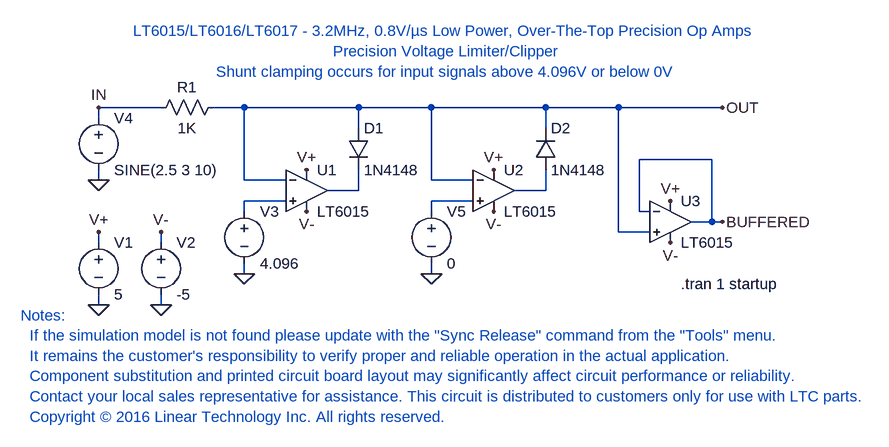
[diagram p0: schematic LT6015_VoltageLimiter.asc]
LT6015_VoltageLimiter.asc, the LTspice schematic file:
Version 4
SHEET 1 1976 820
WIRE 224 64 128 64
WIRE 352 64 304 64
WIRE 528 64 352 64
WIRE 640 64 528 64
WIRE 816 64 640 64
WIRE 928 64 816 64
WIRE 1088 64 928 64
WIRE 128 80 128 64
WIRE 528 96 528 64
WIRE 816 96 816 64
WIRE 1072 144 960 144
WIRE 128 176 128 160
WIRE 352 176 352 64
WIRE 416 176 352 176
WIRE 640 176 640 64
WIRE 704 176 640 176
WIRE 528 192 528 160
WIRE 528 192 480 192
WIRE 816 192 816 160
WIRE 816 192 768 192
WIRE 416 208 352 208
WIRE 704 208 640 208
WIRE 352 224 352 208
WIRE 640 224 640 208
WIRE 960 224 960 144
WIRE 976 224 960 224
WIRE 1072 240 1072 144
WIRE 1072 240 1040 240
WIRE 1088 240 1072 240
WIRE 928 256 928 64
WIRE 976 256 928 256
WIRE 128 272 128 256
WIRE 224 272 224 256
WIRE 352 320 352 304
WIRE 640 320 640 304
WIRE 128 368 128 352
WIRE 224 368 224 352
FLAG 128 368 0
FLAG 224 368 0
FLAG 128 256 V+
FLAG 224 256 V-
FLAG 448 160 V+
FLAG 448 224 V-
FLAG 352 320 0
FLAG 128 176 0
FLAG 736 160 V+
FLAG 736 224 V-
FLAG 1088 64 OUT
FLAG 640 320 0
FLAG 1008 208 V+
FLAG 1008 272 V-
FLAG 1088 240 BUFFERED
FLAG 128 64 IN
SYMBOL voltage 128 256 R0
SYMATTR InstName V1
SYMATTR Value 5
SYMBOL voltage 224 256 R0
SYMATTR InstName V2
SYMATTR Value -5
SYMBOL Opamps\\LT6015 448 192 R0
SYMATTR InstName U1
SYMBOL voltage 352 208 R0
WINDOW 123 24 138 Left 2
WINDOW 39 24 117 Left 2
SYMATTR InstName V3
SYMATTR Value 4.096
SYMBOL diode 512 96 R0
SYMATTR InstName D1
SYMATTR Value 1N4148
SYMBOL voltage 128 64 R0
WINDOW 123 24 138 Left 2
WINDOW 39 24 117 Left 2
SYMATTR InstName V4
SYMATTR Value SINE(2.5 3 10)
SYMBOL res 208 80 R270
WINDOW 0 32 56 VTop 2
WINDOW 3 0 56 VBottom 2
SYMATTR InstName R1
SYMATTR Value 1K
SYMBOL Opamps\\LT6015 736 192 R0
SYMATTR InstName U2
SYMBOL voltage 640 208 R0
WINDOW 123 24 138 Left 2
WINDOW 39 24 117 Left 2
SYMATTR InstName V5
SYMATTR Value 0
SYMBOL diode 800 160 M180
WINDOW 0 24 64 Left 2
WINDOW 3 24 0 Left 2
SYMATTR InstName D2
SYMATTR Value 1N4148
SYMBOL Opamps\\LT6015 1008 240 R0
SYMATTR InstName U3
TEXT 1024 336 Left 2 !.tran 1 startup
TEXT 8 384 Left 2 ;Notes: \n  If the simulation model is not found please update with the "Sync Release" command from the "Tools" menu.\n  It remains the customer's responsibility to verify proper and reliable operation in the actual application.\n  Component substitution and printed circuit board layout may significantly affect circuit performance or reliability.\n  Contact your local sales representative for assistance. This circuit is distributed to customers only for use with LTC parts.\n  Copyright © 2016 Linear Technology Inc. All rights reserved.
TEXT 664 24 Bottom 2 ;LT6015/LT6016/LT6017 - 3.2MHz, 0.8V/µs Low Power, Over-The-Top Precision Op Amps\nPrecision Voltage Limiter/Clipper\nShunt clamping occurs for input signals above 4.096V or below 0V

The netlist it stands for:
* LT6015_VoltageLimiter.asc
V1 V+ 0 5
V2 V- 0 -5
XU1 N003 OUT V+ V- N001 LT6016  ; LT6015, pins In+ In- V+ V- OUT
V3 N003 0 4.096
D1 OUT N001 1N4148
V4 IN 0 SINE(2.5 3 10)
R1 IN OUT 1K
XU2 N004 OUT V+ V- N002 LT6016  ; LT6015, pins In+ In- V+ V- OUT
V5 N004 0 0
D2 N002 OUT 1N4148
XU3 OUT BUFFERED V+ V- BUFFERED LT6016  ; LT6015, pins In+ In- V+ V- OUT
.model D D
.lib standard.dio
.tran 1 startup
* Notes:
*   If the simulation model is not found please update with the "Sync Release" command from the "Tools" menu.
*   It remains the customer's responsibility to verify proper and reliable operation in the actual application.
*   Component substitution and printed circuit board layout may significantly affect circuit performance or reliability.
*   Contact your local sales representative for assistance. This circuit is distributed to customers only for use with LTC parts.
*   Copyright © 2016 Linear Technology Inc. All rights reserved.
* LT6015/LT6016/LT6017 - 3.2MHz, 0.8V/µs Low Power, Over-The-Top Precision Op Amps
* Precision Voltage Limiter/Clipper
* Shunt clamping occurs for input signals above 4.096V or below 0V
.lib LTC2.lib
.backanno
.end